# EAGLE schematic Ver_9 (EAGLE 9.6.2)

## Sheet 1 of 2
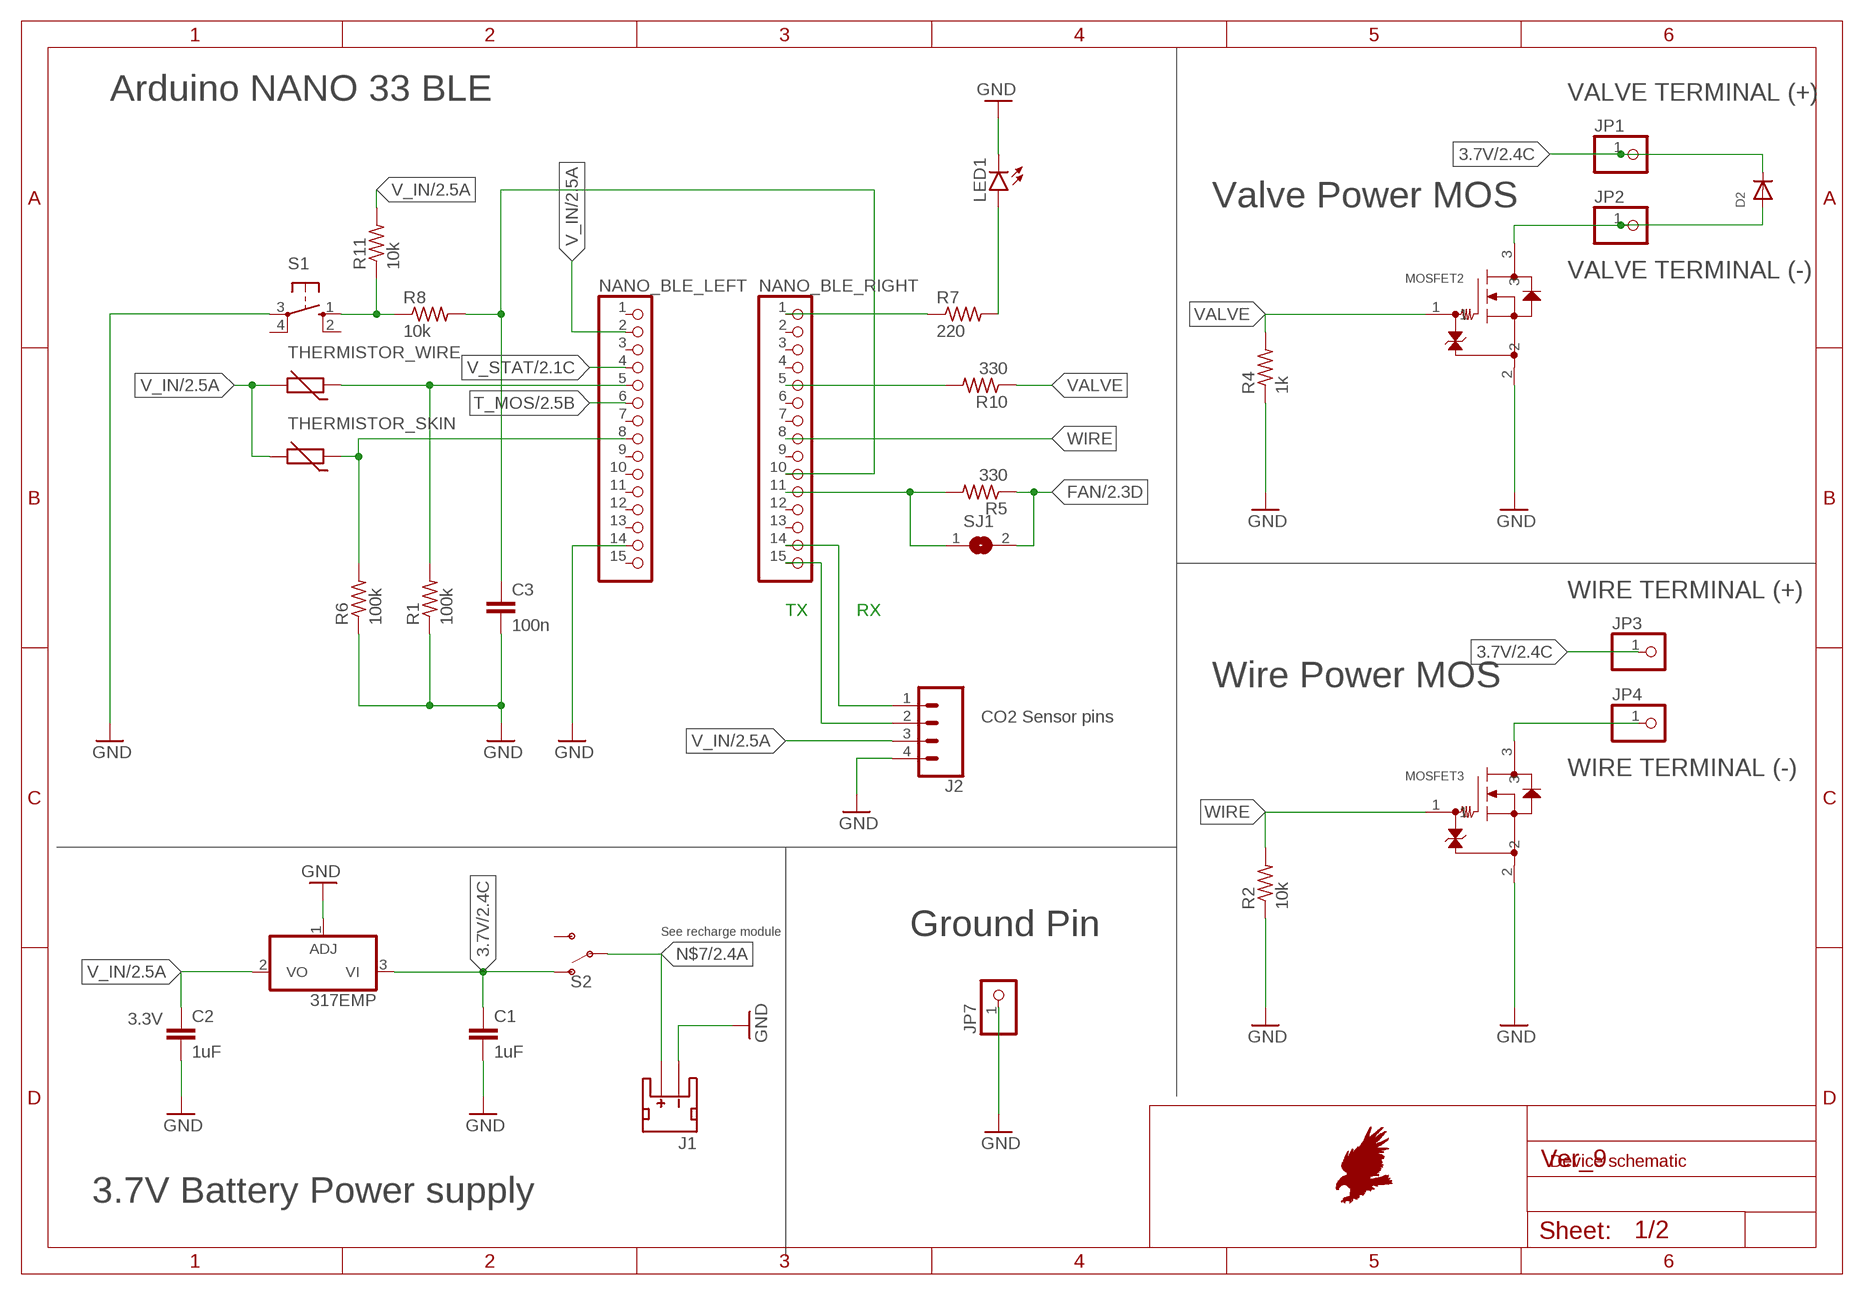
[diagram p0: schematic, sheet 1]

### Parts
C1  1uF  C-EUC0603  [C0603]
C2  1uF  C-EUC0603  [C0603]
C3  100n  C-EUC0603  [C0603]
D2  DIODESMA  [SMADIODE]
IC1  317EMP  [SOT223]
J1  JST_2MM_MALE  [JST-2-SMD]
J2  CONN_04  [1X04]
JP1  PINHD-1X1  [1X01]
JP2  PINHD-1X1  [1X01]
JP3  PINHD-1X1  [1X01]
JP4  PINHD-1X1  [1X01]
JP7  PINHD-1X1  [1X01]
LED1  LEDCHIPLED_0805  [CHIPLED_0805]
MOSFET2  SSM3K2615RSOT-23F_TOS-M  [SOT-23F_TOS-M]
MOSFET3  SSM3K2615RSOT-23F_TOS-M  [SOT-23F_TOS-M]
NANO_BLE_LEFT  PINHD-1X15  [1X15]
NANO_BLE_RIGHT  PINHD-1X15  [1X15]
R1  100k  R-US_R0603  [R0603]
R2  10k  R-US_R0603  [R0603]
R4  1k  R-US_R0603  [R0603]
R5  330  R-US_R0603  [R0603]
R6  100k  R-US_R0603  [R0603]
R7  220  R-US_R0603  [R0603]
R8  10k  R-US_R0603  [R0603]
R10  330  R-US_R0603  [R0603]
R11  10k  R-US_R0603  [R0603]
S1  10-XX  [B3F-10XX]
S2  SWITCH-SPDT-PTH-11.6X4.0MM  [SWITCH_SPDT_PTH_11.6X4.0MM]
SJ1  SOLDERJUMPER  [SOLDERJUMPER_ARROW_NOPASTE]
THERMISTOR_SKIN  THERMISTOR-5  [R-5]
THERMISTOR_WIRE  THERMISTOR-5  [R-5]

### Nets
3.7V: C1.1 D2.C IC1.3(VI) JP1.1 JP3.1 S2.1(O) ; also sheet 2
FAN: R5.1 SJ1.2 ; also sheet 2
GND: C1.2 C2.2 C3.2 IC1.1(ADJ) J1.1(-) J2.4 JP7.1 LED1.C MOSFET2.2 MOSFET3.2 NANO_BLE_LEFT.14 R1.1 R2.1 R4.1 R6.1 S1.3(P) ; also sheet 2
N$1: NANO_BLE_RIGHT.1 R7.1
N$2: LED1.A R7.2
N$3: C3.1 NANO_BLE_RIGHT.10 R8.2
N$4: R8.1 R11.1 S1.1(S)
N$5: NANO_BLE_LEFT.5 R1.2 THERMISTOR_WIRE.1
N$6: NANO_BLE_LEFT.8 R6.2 THERMISTOR_SKIN.1
N$7: J1.2(+) S2.2(P) ; also sheet 2
N$9: NANO_BLE_RIGHT.11 R5.2 SJ1.1
N$10: D2.A JP2.1 MOSFET2.3
N$11: JP4.1 MOSFET3.3
N$13: NANO_BLE_RIGHT.5 R10.2
N$14: J2.2 NANO_BLE_RIGHT.15
N$19: J2.1 NANO_BLE_RIGHT.14
T_MOS: NANO_BLE_LEFT.6 ; also sheet 2
V_IN: C2.1 IC1.2(VO) J2.3 NANO_BLE_LEFT.2 R11.2 THERMISTOR_SKIN.2 THERMISTOR_WIRE.2 ; also sheet 2
V_STAT: NANO_BLE_LEFT.4 ; also sheet 2
VALVE: MOSFET2.1 R4.2 R10.1
WIRE: MOSFET3.1 NANO_BLE_RIGHT.8 R2.2
Unconnected: J1.NC1(PAD1) J1.NC2(PAD2) NANO_BLE_LEFT.1 NANO_BLE_LEFT.3 NANO_BLE_LEFT.7 NANO_BLE_LEFT.9 NANO_BLE_LEFT.10 NANO_BLE_LEFT.11 NANO_BLE_LEFT.12 NANO_BLE_LEFT.13 NANO_BLE_LEFT.15 NANO_BLE_RIGHT.2 NANO_BLE_RIGHT.3 NANO_BLE_RIGHT.4 NANO_BLE_RIGHT.6 NANO_BLE_RIGHT.7 NANO_BLE_RIGHT.9 NANO_BLE_RIGHT.12 NANO_BLE_RIGHT.13 S1.2(S1) S1.4(P1) S2.3(S)

### Notes on the sheet
- Arduino NANO 33 BLE | VALVE TERMINAL (+)
- Valve Power MOS
- VALVE TERMINAL (-)
- WIRE TERMINAL (+)
- TX | RX
- Wire Power MOS
- CO2 Sensor pins
- WIRE TERMINAL (-)
- See recharge module | Ground Pin
- 3.3V
- Device schematic
- 3.7V Battery Power supply

## Sheet 2 of 2
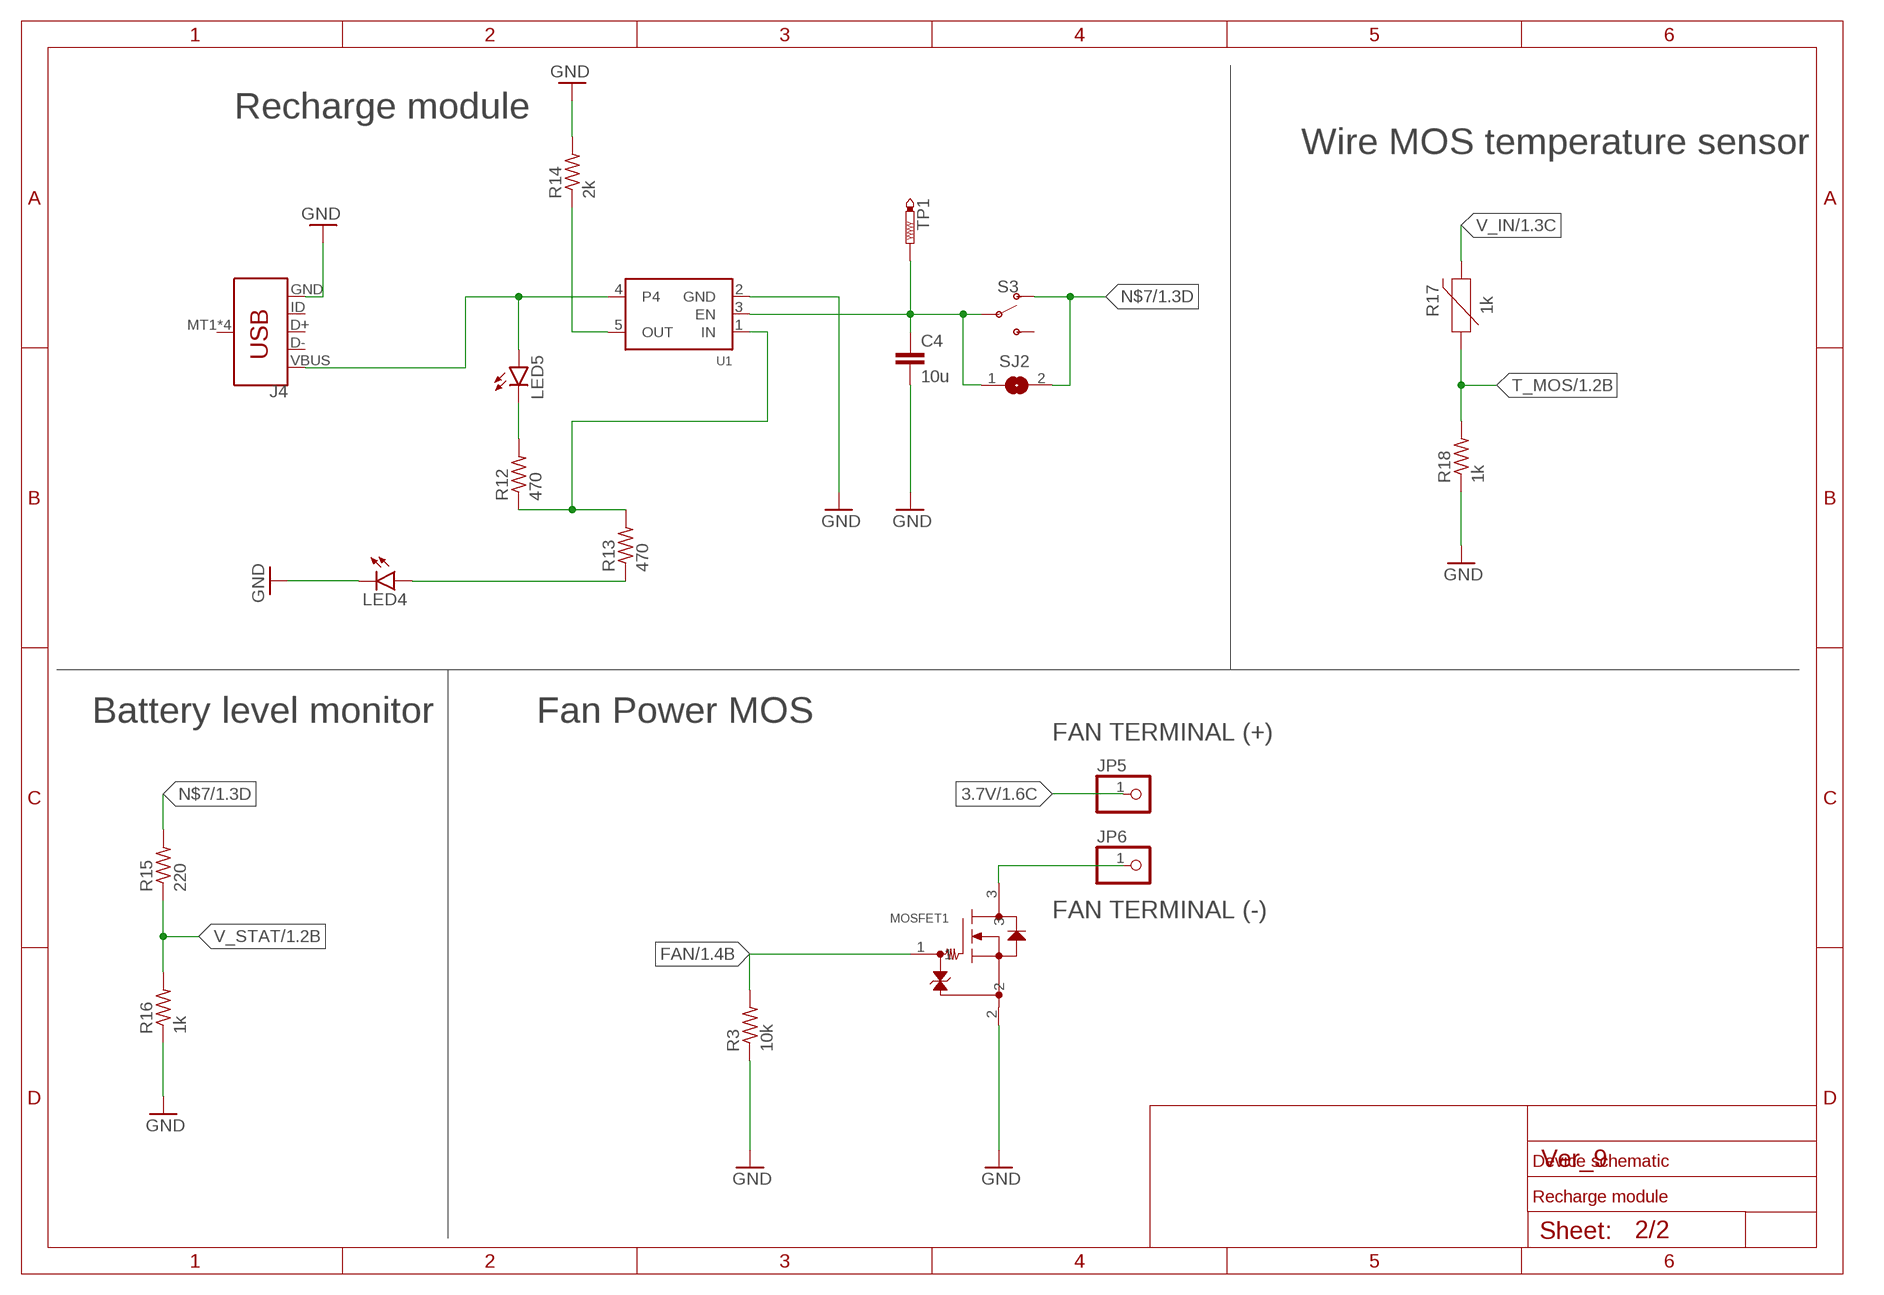
[diagram p1: schematic, sheet 2]

### Parts
C4  10u  C-EUC0603  [C0603]
J4  USB_MICRO-B_SMT  [USB-MICROB]
JP5  PINHD-1X1  [1X01]
JP6  PINHD-1X1  [1X01]
LED4  LEDCHIPLED_0805  [CHIPLED_0805]
LED5  LEDCHIPLED_0805  [CHIPLED_0805]
MOSFET1  SSM3K2615RSOT-23F_TOS-M  [SOT-23F_TOS-M]
R3  10k  R-US_R0603  [R0603]
R12  470  R-US_R0603  [R0603]
R13  470  R-US_R0603  [R0603]
R14  2k  R-US_R0603  [R0603]
R15  220  R-US_R0603  [R0603]
R16  1k  R-US_R0603  [R0603]
R17  1k  NTC-THERMISTOR-0603  [0603]
R18  1k  R-US_R0603  [R0603]
S3  SWITCH-SPDT-PTH-11.6X4.0MM  [SWITCH_SPDT_PTH_11.6X4.0MM]
SJ2  SOLDERJUMPER  [SOLDERJUMPER_ARROW_NOPASTE]
TP1  PTR1B1,27  [B1,27]
U1  VREG_SOT23-5  [SOT23-5]

### Nets
3.7V: JP5.1 ; also sheet 1
FAN: MOSFET1.1 R3.2 ; also sheet 1
GND: C4.2 J4.GND LED4.C MOSFET1.2 R3.1 R14.2 R16.1 R18.1 U1.2(GND) ; also sheet 1
N$7: R15.2 S3.1(O) SJ2.2 ; also sheet 1
N$8: JP6.1 MOSFET1.3
N$15: J4.VBUS LED5.A U1.4
N$16: LED5.C R12.2
N$17: LED4.A R13.1
N$18: R12.1 R13.2 U1.1(IN)
N$20: C4.1 S3.2(P) SJ2.1 TP1.TP U1.3(EN)
N$21: R14.1 U1.5(OUT)
T_MOS: R17.1 R18.2 ; also sheet 1
V_IN: R17.2 ; also sheet 1
V_STAT: R15.1 R16.2 ; also sheet 1
Unconnected: J4.D+ J4.D- J4.ID J4.MT1(SHIELD) J4.MT2(SHIELD) J4.P$1(SHIELD) J4.P$2(SHIELD) S3.3(S)

### Notes on the sheet
- Recharge module
- Wire MOS temperature sensor
- Battery level monitor | Fan Power MOS
- FAN TERMINAL (+)
- FAN TERMINAL (-)
- Device schematic
- Recharge module

## Library data of the parts
C1-C4 = rcl:C-EU: CAPACITOR, European symbol; SPICEPREFIX: C
D2 = adafruit:DIODE: Diode SMADIODE - SMA Surface Mount Package 20V 1A Schottky Diode Digikey: 641-1014-6-ND DO-1N4148 - Through Hole Small Current Diode SOD-123 20V 1 A (.5mV Vf) Schottky Diode - Digikey: MBRX120TPMSCT-ND SOD-323 10V 570mA (.38mV Vf, 3ns) Schottky Diode - Digikey: ZLLS410CT-ND SOD-523 30V 30mA Schottky Diode (RB751S-40TE61) - Digikey: RB751S-40TE61CT-ND SOT23-R/W - SOT23 Package (R = Solder Paste/Reflow Ovens, W = Hand-Soldering) BAT54Film 40V 300mA - Digikey: 497-7162-1-ND
IC1 = LD1117:*317: Positive VOLTAGE REGULATOR
J1 = SparkFun-Connectors:JST_2MM_MALE: JST 2MM MALE RA CONNECTOR Two pin, compact surface mount connector. Commonly used as a battery input connection point. We really like the solid locking feeling and high current rating on these small connectors. We use these all the time as battery connectors. Mates to single-cell LiPo batteries. Here is the connector we sell at SparkFun: JST Right Angle Connector - White <https://www.sparkfun.com/products/8612> (PRT-08612) Datasheet <http://www.sparkfun.com/datasheets/Prototyping/Connectors/JST-Horizontal.pdf> It was used on these SparkFun products: SparkFun MOSFET Power Controller <https://www.sparkfun.com/products/11214> (PRT-11214) SparkFun Battery Babysitter - LiPo Battery Manager <https://www.sparkfun.com/products/13777> (PRT-13777) And many, many others that required a lipo battery connection.; PROD_ID: CONN-11443; SF_ID: PRT-08612
J2 = SparkFun-Connectors:CONN_04: Multi connection point. Often used as Generic Header-pin footprint for 0.1 inch spaced/style header connections On any of the 0.1 inch spaced packages, you can populate with these: Break Away Headers - Straight <https://www.sparkfun.com/products/116> (PRT-00116) Break Away Male Headers - Right Angle <https://www.sparkfun.com/products/553> (PRT-00553) Female Headers <https://www.sparkfun.com/products/115> (PRT-00115) Break Away Headers - Machine Pin <https://www.sparkfun.com/products/117> (PRT-00117) Break Away Female Headers - Swiss Machine Pin <https://www.sparkfun.com/products/743> (PRT-00743) For SCREWTERMINALS and SPRING TERMINALS visit here: Screw Terimnals on SparkFun.com <https://www.sparkfun.com/search/results?term=Screw+Terminals> (5mm/3.5mm/2.54mm spacing) This device is also useful as a general connection point to wire up your design to another part of your project. Our various solder wires solder well into these plated through hole pads. Hook-Up Wire - Assortment (Stranded, 22 AWG) <https://www.sparkfun.com/products/11375> (PRT-11375) Hook-Up Wire - Assortment (Solid Core, 22 AWG) <https://www.sparkfun.com/products/11367> (PRT-11367) View the entire wire category on our website here <https://www.sparkfun.com/categories/141> Special notes: Molex polarized connector foot print use with SKU : PRT-08231 with associated crimp pins and housings. 1MM SMD Version SKU: PRT-10208; PROD_ID: CONN-09696
J4 = SparkFun-Connectors:USB_MICRO-B: USB Type Micro-B Connector Male/female and PTH/SMT variants SparkFun Products: SparkFun microB USB Breakout <https://www.sparkfun.com/products/12035> SparkFun USB microB Plug Breakout <https://www.sparkfun.com/products/10031> SparkFun ESP8266 Thing <https://www.sparkfun.com/products/13231>; PROD_ID: CONN-09505; SF_ID: PRT-08533
JP1-JP7 = pinhead:PINHD-1X1: PIN HEADER
LED1 LED4 LED5 = led:LED: LED OSRAM: - CHIPLED LG R971, LG N971, LY N971, LG Q971, LY Q971, LO R971, LY R971 LH N974, LH R974 LS Q976, LO Q976, LY Q976 LO Q996 - Hyper CHIPLED LW Q18S LB Q993, LB Q99A, LB R99A - SideLED LS A670, LO A670, LY A670, LG A670, LP A670 LB A673, LV A673, LT A673, LW A673 LH A674 LY A675 LS A676, LA A676, LO A676, LY A676, LW A676 LS A679, LY A679, LG A679 - Hyper Micro SIDELED® LS Y876, LA Y876, LO Y876, LY Y876 LT Y87S - SmartLED LW L88C, LW L88S LB L89C, LB L89S, LG L890 LS L89K, LO L89K, LY L89K LS L896, LA L896, LO L896, LY L896 - TOPLED LS T670, LO T670, LY T670, LG T670, LP T670 LSG T670, LSP T670, LSY T670, LOP T670, LYG T670 LG T671, LOG T671, LSG T671 LB T673, LV T673, LT T673, LW T673 LH T674 LS T676, LA T676, LO T676, LY T676, LB T676, LH T676, LSB T676, LW T676 LB T67C, LV T67C, LT T67C, LS T67K, LO T67K, LY T67K, LW E67C LS E67B, LA E67B, LO E67B, LY E67B, LB E67C, LV E67C, LT E67C LW T67C LS T679, LY T679, LG T679 LS T770, LO T770, LY T770, LG T770, LP T770 LB T773, LV T773, LT T773, LW T773 LH T774 LS E675, LA E675, LY E675, LS T675 LS T776, LA T776, LO T776, LY T776, LB T776 LHGB T686 LT T68C, LB T68C - Hyper Mini TOPLED® LB M676 - Mini TOPLED Santana® LG M470 LS M47K, LO M47K, LY M47K Source: http://www.osram.convergy.de LUXEON: - LUMILED® LXK2-PW12-R00, LXK2-PW12-S00, LXK2-PW14-U00, LXK2-PW14-V00 LXK2-PM12-R00, LXK2-PM12-S00, LXK2-PM14-U00 LXK2-PE12-Q00, LXK2-PE12-R00, LXK2-PE12-S00, LXK2-PE14-T00, LXK2-PE14-U00 LXK2-PB12-K00, LXK2-PB12-L00, LXK2-PB12-M00, LXK2-PB14-N00, LXK2-PB14-P00, LXK2-PB14-Q00 LXK2-PR12-L00, LXK2-PR12-M00, LXK2-PR14-Q00, LXK2-PR14-R00 LXK2-PD12-Q00, LXK2-PD12-R00, LXK2-PD12-S00 LXK2-PH12-R00, LXK2-PH12-S00 LXK2-PL12-P00, LXK2-PL12-Q00, LXK2-PL12-R00 Source: www.luxeon.com KINGBRIGHT: KA-3528ASYC Source: www.kingbright.com
MOSFET1-MOSFET3 = PowerMosToshiba:SSM3K2615R; COPYRIGHT: Copyright (C) 2021 Ultra Librarian. All rights reserved.; DIGI-KEY_PART_NUMBER_1: SSM3K2615RLFCT-ND; DIGI-KEY_PART_NUMBER_2: SSM3K2615RLFDKR-ND; DIGI-KEY_PART_NUMBER_3: SSM3K2615RLFTR-ND; MANUFACTURER_PART_NUMBER: SSM3K2615R; MFR_NAME: Toshiba Electronic Devices & Storage Co.
NANO_BLE_LEFT NANO_BLE_RIGHT = pinhead:PINHD-1X15: PIN HEADER
R1-R8 R10-R16 R18 = rcl:R-US_: RESISTOR, American symbol; SPICEPREFIX: R
R17 = SparkFun-Resistors:NTC-THERMISTOR: NTC Thermistor An NTC thermistor's resistance decreases as temperature rises. Applications: Resistance Thermometer - temperature monitoring Inrush current limiter Heat source; PROD_ID: RES-13608; VALUE: 10k
S1 = switch-omron:10-XX: OMRON SWITCH; MPN: B3F-1000; OC_FARNELL: 176432; OC_NEWARK: 36M3542
S2 S3 = SparkFun-Switches:SWITCH-SPDT: Single Pole, Double Throw (SPDT) Switch Single-pole, double-throw (SPDT) switch. Variant Overview SMD-AYZ0202 Surface Mount DPDT Switch <https://www.sparkfun.com/products/597> (COM-00597) Used on e.g. LilyPad Arduino USB - ATmega32U4 Board <https://www.sparkfun.com/products/12049> PTH-11.6X4.0MM SPDT Mini Power Switch <https://www.sparkfun.com/products/102> (COM-00102) Used on e.g. SparkFun Simon Says - Through-Hole Soldering Kit <https://www.sparkfun.com/products/10547> (KIT-10547) PTH-11.6X4.0MM-KIT KIT version of SPDT Mini Power Switch - Simplifies soldering by removing tStop of switch pins - only one side can be soldered. PTH-11.6X4.0MM-LOCK LOCK version of SPDT Mini Power Switch - Offset pins hold switch in place for easier soldering. SMD-RIGHT-ANGLE Surface Mount Right Angle Switch <https://www.sparkfun.com/products/10860> (COM-10860) Used on e.g. SparkFun ESP8266 Thing <https://www.sparkfun.com/products/13231>; PROD_ID: SWCH-08261; SF_SKU: COM-00102
SJ1 SJ2 = microbuilder:SOLDERJUMPER: SMD Solder JUMPER Solder the two pads together to create a connection, or remove the solder to break it. REFLOW - Use this footprint for solder paste and reflow ovens. WAVE - Use this footprint for hand-soldering (larger pads). CLOSED - Has a trace between the two pads to ensure it is closed by default. The trace needs to be cut to disable the jumper, and can be closed again by creating a solder bridge between the two pads.; BOM: EXCLUDE
THERMISTOR_SKIN THERMISTOR_WIRE = varistor:THERMISTOR: THERMISTOR
TP1 = testpad:PTR1: TEST PIN
U1 = microbuilder:VREG_SOT23-5: SOT23-5 Fixed Voltage Regulators To better organise some of the SOT23-5 fixed voltage regulators in this library, this new part was created. Part Current Out V Out V In V Dropout Digikey Part No. ADP121 150mA 3.3V 3.4-5.5V 0.09V @ 150mA ADP121-AUJZ33R7CT-ND ADP121 150mA 3.0V 3.1-5.5V 0.09V @ 150mA ADP121-AUJZ30R7CT-ND ADP122 300mA 3.3V 3.4-5.5V 0.085V @ 300mA ADP122AUJZ-3.3-R7CT-ND ADP1712 300mA 3.3V 3.5-5.5V 0.17V @ 300mA ADP1712AUJZ-3.3-R7TR-ND AP7311 (Low Cost) 150mA 3.3V 3.5-6V 0.15V @ 150mA AP7311-33WG-7DICT-ND LD39015M18R 150mA 1.8V 1.9V-5.5V 0.08V @ 100mA 497-6977-1-ND MCP1824T-3302E/OT 300mA 3.3V 3.5V-6V 0.2V @ 300mA MCP1824T-3302E/OTCT-ND MIC5205-2.5YM5 TR 150mA 2.5V 2.7-16V 0.165V @ 150mA 576-1257-2-ND MIC5205-3.0YM5 TR 150mA 3.0V 3.2V-16V 0.165V @ 150mA 576-1258-2-ND MIC5205-3.3YM5 TR 150mA 3.3V 3.5V-16V 0.165V @ 150mA 576-1259-2-ND TPS780330220 150mA 3.3V+2.2V 3.6-5.5V 250mV Max 296-23332-1-ND TDA3663/N1,135 100mA 3.3V 3.5-45V 0.18V @ 50mA 568-5343-1-ND